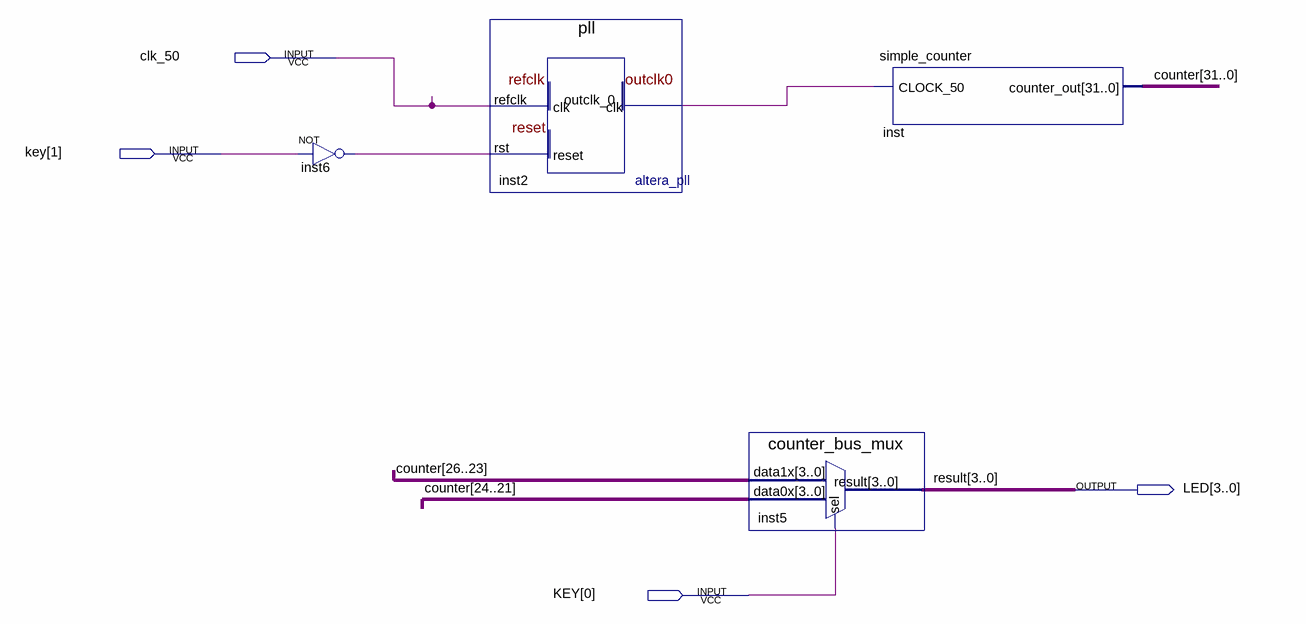
[diagram p0: schematic sheet]
// Quartus schematic example.bdf as structural Verilog: 4 symbols, 4 pins
module example (
  input  clk_50,
  input  [1:0] key,
  output [3:0] LED
);

  wire inst2_outclk_0, inst6_out;
  wire [31:0] counter;

  not inst6 (inst6_out, key[1]);
  pll inst2 (.refclk(clk_50), .rst(inst6_out), .outclk_0(inst2_outclk_0));
  counter_bus_mux inst5 (.data1x(counter[26:23]), .data0x(counter[24:21]), .sel(key[0]), .result(LED));
  simple_counter inst (.CLOCK_50(inst2_outclk_0), .counter_out(counter));

  // Other names for the same wires on the sheet: result[3:0] = LED
endmodule
